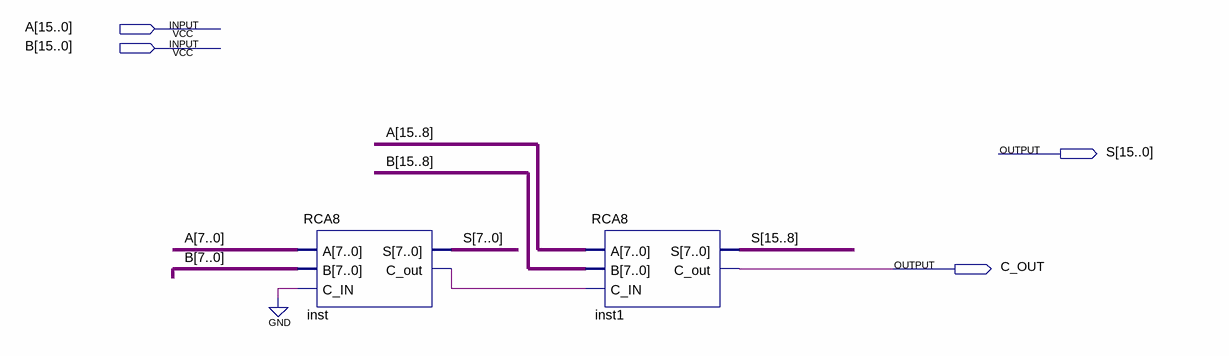
[diagram p0: schematic sheet]
// Quartus schematic RCA16.bdf as structural Verilog: 2 symbols, 4 pins
module RCA16 (
  input  [15:0] A,
  input  [15:0] B,
  output [15:0] S,
  output C_OUT
);

  wire inst_c_out;

  RCA8 inst (.A(A[7:0]), .B(B[7:0]), .C_IN(1'b0), .S(S[7:0]), .C_out(inst_c_out));
  RCA8 inst1 (.A(A[15:8]), .B(B[15:8]), .C_IN(inst_c_out), .S(S[15:8]), .C_out(C_OUT));
endmodule
